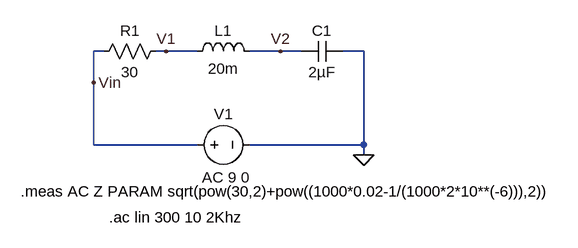
[diagram p0: schematic rlc_ac_analysis.asc]
rlc_ac_analysis.asc, the LTspice schematic file:
Version 4
SHEET 1 912 680
WIRE 48 112 32 112
WIRE 144 112 128 112
WIRE 192 112 144 112
WIRE 320 112 272 112
WIRE 352 112 320 112
WIRE 448 112 416 112
WIRE 32 160 32 112
WIRE 32 256 32 160
WIRE 192 256 32 256
WIRE 448 256 448 112
WIRE 448 256 272 256
WIRE 448 272 448 256
FLAG 448 272 0
FLAG 32 160 Vin
FLAG 144 112 V1
FLAG 320 112 V2
SYMBOL res 144 96 R90
WINDOW 0 0 56 VBottom 2
WINDOW 3 32 56 VTop 2
SYMATTR InstName R1
SYMATTR Value 30
SYMBOL ind 176 128 R270
WINDOW 0 32 56 VTop 2
WINDOW 3 5 56 VBottom 2
SYMATTR InstName L1
SYMATTR Value 20m
SYMBOL cap 416 96 R90
WINDOW 0 0 32 VBottom 2
WINDOW 3 32 32 VTop 2
SYMATTR InstName C1
SYMATTR Value 2µF
SYMBOL voltage 176 256 R270
WINDOW 0 32 56 VTop 2
WINDOW 3 -32 56 VBottom 2
WINDOW 123 -35 60 VBottom 2
WINDOW 39 0 0 Left 0
SYMATTR InstName V1
SYMATTR Value ""
SYMATTR Value2 AC 9 0
TEXT -80 328 Left 2 !.meas AC Z PARAM sqrt(pow(30,2)+pow((1000*0.02-1/(1000*2*10**(-6))),2))
TEXT 56 368 Left 2 !.ac lin 300 10 2Khz

The netlist it stands for:
* rlc_ac_analysis.asc
R1 V1 Vin 30
L1 V1 V2 20m
C1 0 V2 2µF
V1 Vin 0 AC 9 0
.meas AC Z PARAM sqrt(pow(30,2)+pow((1000*0.02-1/(1000*2*10**(-6))),2))
.ac lin 300 10 2Khz
.backanno
.end